# EAGLE board modular_expansion_system_graphics_and_sound (EAGLE 9.2.1)
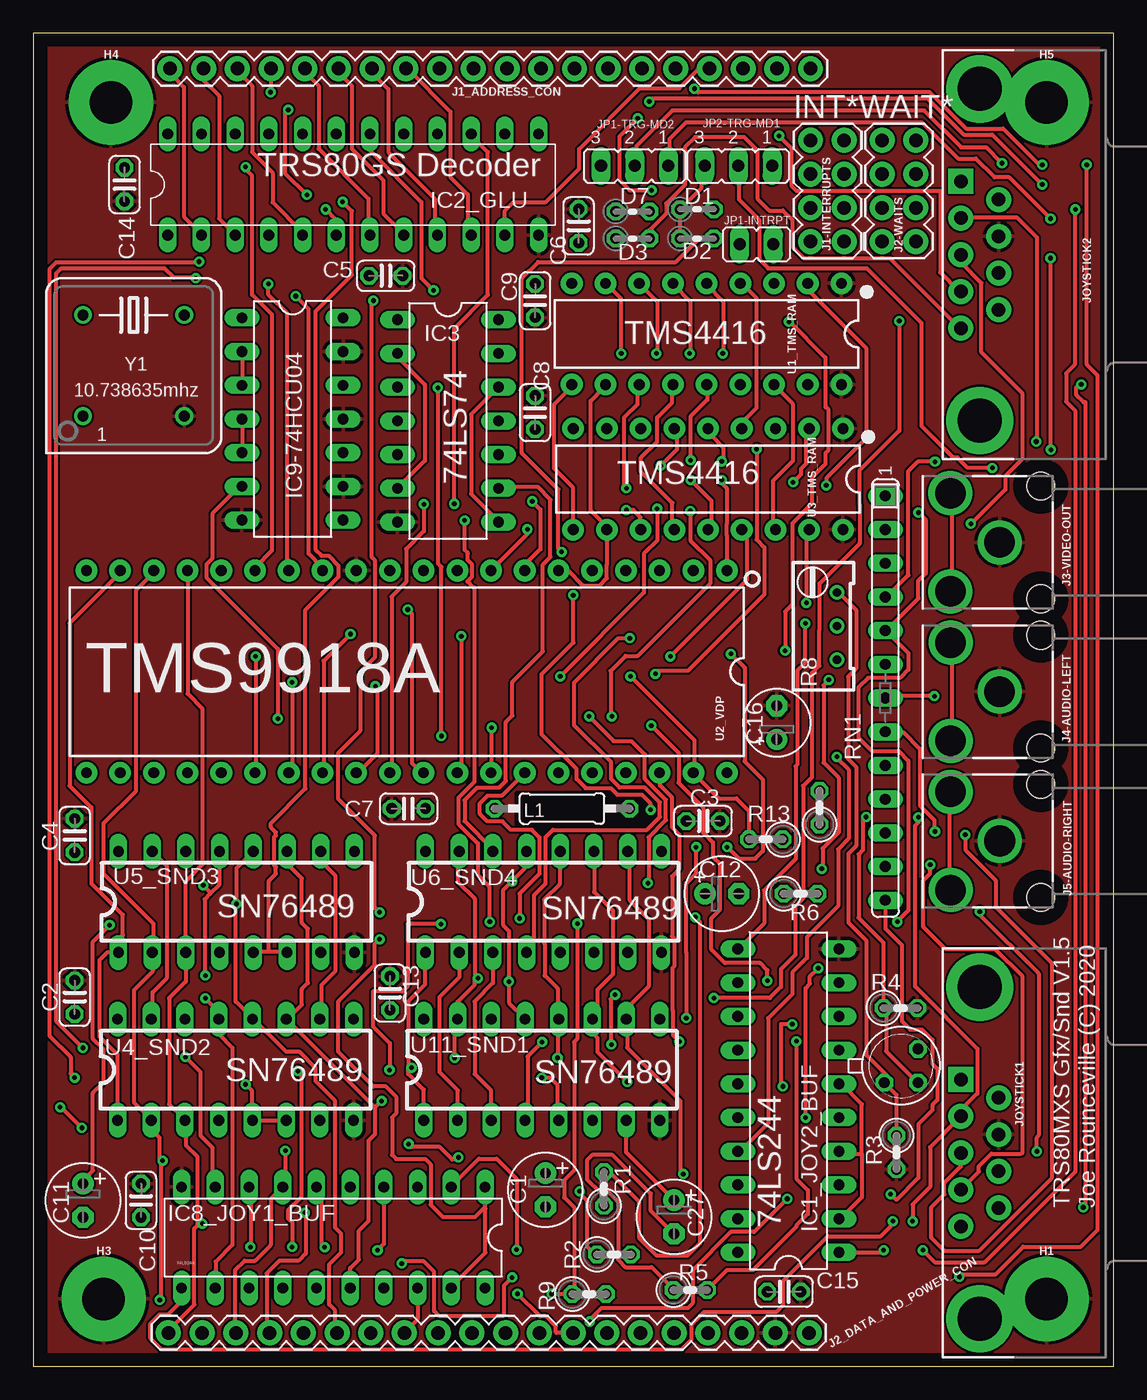
[diagram p1: board, top side]
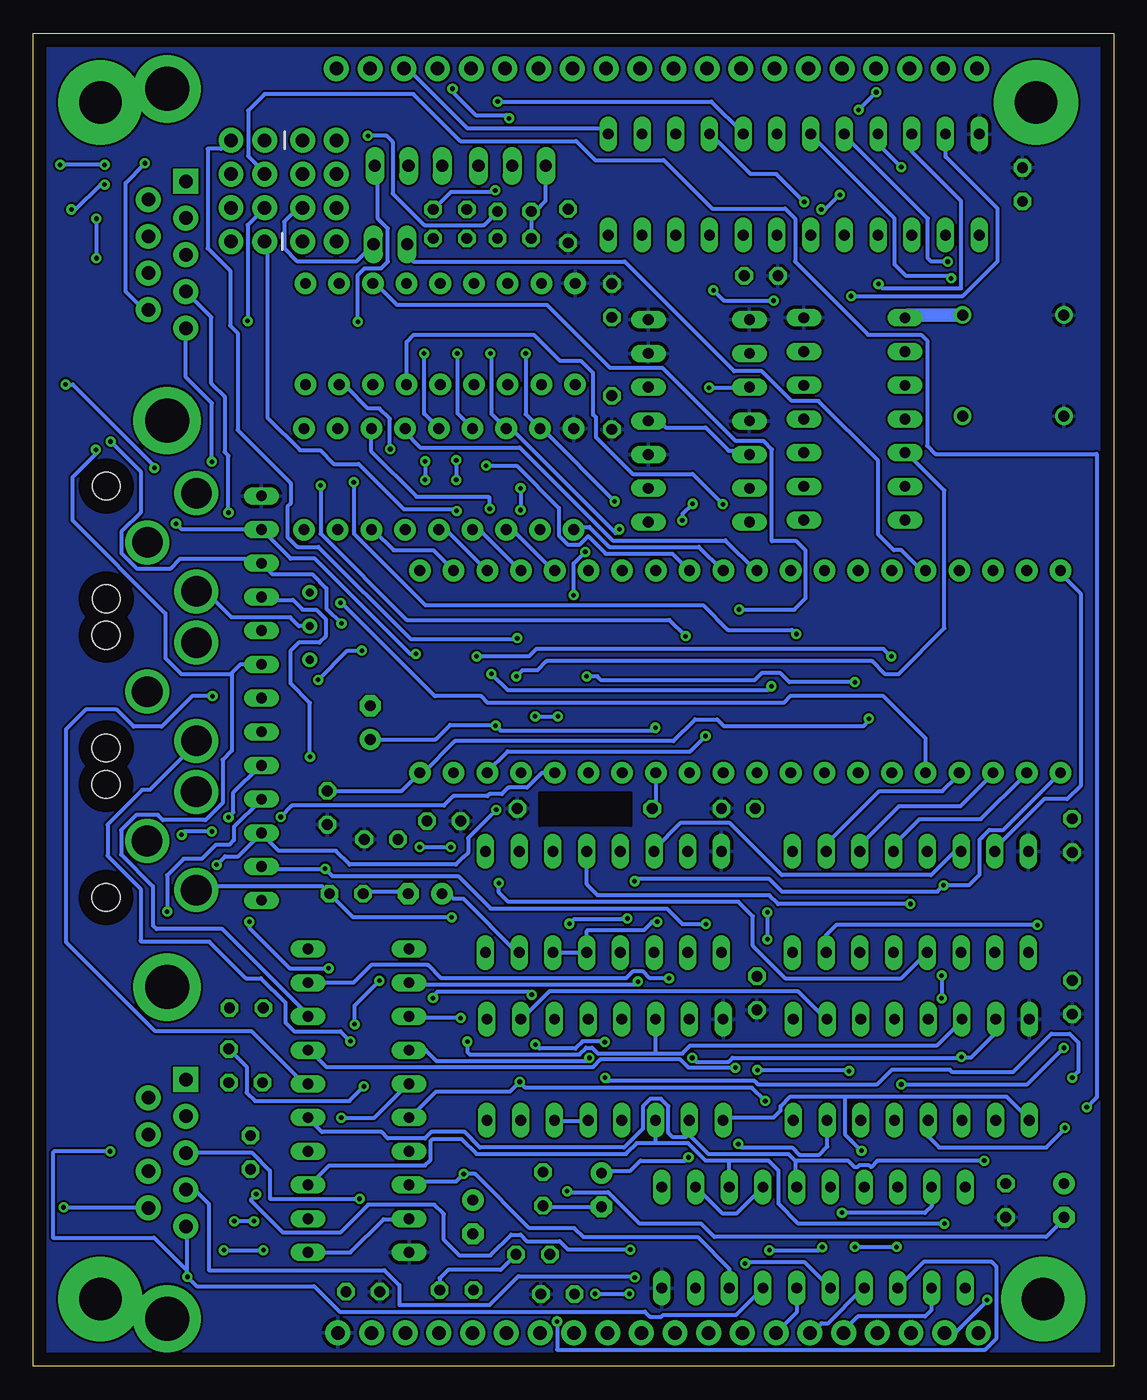
[diagram p2: board, bottom side, seen from below]

Size 81.4 x 100.47 mm. Coordinates in mm from the lower left corner, seen from the top.
Outline: 0,0 81.4,0 81.4,100.47 0,100.47 0,0
Copper layers (1*16): Top 0.035mm / dielectric 1.5mm / Bottom 0.035mm
Design rules "default": minimum track width 6mil, minimum drill 0.35mm, track to track 6mil, track to pad 6mil, pad to pad 6mil, via to via 6mil, smd to smd 6mil, copper to edge 40mil, drill to drill 6mil, minimum pad ring 10mil, minimum via ring 8mil, stop-mask expansion 4mil, vias tented up to drill 0mil, thermal gap 10mil
Net classes: 0 default: width 0.3 mm

## Footprints (pad centres in the part's own frame; a part is rotated, then mirrored left to right if it is on the bottom)
E2,5-6 = drill 0.813 pad 1.6: + -1.27,0 | drill 0.813 pad 1.6 octagon: - 1.27,0
C025-024X044 = drill 0.813 octagon: 1 -1.27,0; 2 1.27,0
E2,5-5 = drill 0.813 pad 1.6: + -1.27,0 | drill 0.813 pad 1.6 octagon: - 1.27,0
0204V = drill 0.813 octagon: 1 -1.27,0; 2 1.27,0
STANDOFF-ELECTRICAL = drill 3.2 pad 6.35: P1 0,0
DIL20 = drill 0.813 long: 1 -11.43,-3.81; 2 -8.89,-3.81; 3 -6.35,-3.81; 4 -3.81,-3.81; 5 -1.27,-3.81; 6 1.27,-3.81; 7 3.81,-3.81; 8 6.35,-3.81; 9 8.89,-3.81; 10 11.43,-3.81; 11 11.43,3.81; 12 8.89,3.81; 13 6.35,3.81; 14 3.81,3.81; 15 1.27,3.81; 16 -1.27,3.81; 17 -3.81,3.81; 18 -6.35,3.81; 19 -8.89,3.81; 20 -11.43,3.81
DIP24SKI = drill 0.813 pad 1.27 long: 1 -11.43,-3.81; 2 -8.89,-3.81; 3 -6.35,-3.81; 4 -3.81,-3.81; 5 -1.27,-3.81; 6 1.27,-3.81; 7 3.81,-3.81; 8 6.35,-3.81; 9 8.89,-3.81; 10 11.43,-3.81; 11 13.97,-3.81; 12 16.51,-3.81; 13 16.51,3.81; 14 13.97,3.81; 15 11.43,3.81; 16 8.89,3.81; 17 6.35,3.81; 18 3.81,3.81; 19 1.27,3.81; 20 -1.27,3.81; 21 -3.81,3.81; 22 -6.35,3.81; 23 -8.89,3.81; 24 -11.43,3.81
DIL14 = drill 0.813 long: 1 -7.62,-3.81; 2 -5.08,-3.81; 3 -2.54,-3.81; 4 0,-3.81; 5 2.54,-3.81; 6 5.08,-3.81; 7 7.62,-3.81; 8 7.62,3.81; 9 5.08,3.81; 10 2.54,3.81; 11 0,3.81; 12 -2.54,3.81; 13 -5.08,3.81; 14 -7.62,3.81
2X4 = drill 1.016 pad 1.88: 1 -3.81,-1.27; 2 -3.81,1.27; 3 -1.27,-1.27; 4 -1.27,1.27; 5 1.27,-1.27; 6 1.27,1.27; 7 3.81,-1.27; 8 3.81,1.27
1X20 = drill 1.016 pad 1.88: 1 0,0; 2 2.54,0; 3 5.08,0; 4 7.62,0; 5 10.16,0; 6 12.7,0; 7 15.24,0; 8 17.78,0; 9 20.32,0; 10 22.86,0; 11 25.4,0; 12 27.94,0; 13 30.48,0; 14 33.02,0; 15 35.56,0; 16 38.1,0; 17 40.64,0; 18 43.18,0; 19 45.72,0; 20 48.26,0
RCA = drill 2.3: PIN 3.7,3.7; SHELL 0,0; SWITCH 3.7,-3.7 | hole 2.1: -3.1,4.25; -3.1,-4.25
DB9 = drill 1.016 pad 1.88 square: 1 -5.54,-1.42 | drill 1.016 pad 1.88: 2 -2.77,-1.42; 3 0,-1.42; 4 2.77,-1.42; 5 5.54,-1.42; 6 -4.15,1.42; 7 -1.38,1.42; 8 1.38,1.42; 9 4.15,1.42 | drill 3.302 pad 5.08: G1 -12.5,0; G2 12.5,0
JP1 = drill 0.914 long: 1 0,-1.27; 2 0,1.27
JP2 = drill 0.914 long: 1 -2.54,0; 2 0,0; 3 2.54,0
0207/10 = drill 0.813 octagon: 1 -5.08,0; 2 5.08,0
TO18A = drill 0.813 octagon: B 1.27,-1.27; C 1.27,1.27; E -1.27,-1.27
0207/2V = drill 0.813 octagon: 1 -1.27,0; 2 1.27,0
RTRIM64W = drill 0.61: 1 1.27,-2.54; 2 1.27,0; 3 1.27,2.54
SIL13 = drill 0.813 long: 1 -15.24,0; 2 -12.7,0; 3 -10.16,0; 4 -7.62,0; 5 -5.08,0; 6 -2.54,0; 7 0,0; 8 2.54,0; 9 5.08,0; 10 7.62,0; 11 10.16,0; 12 12.7,0; 13 15.24,0
DIP18 = drill 0.813 pad 1.626: 1 -10.16,-3.81; 2 -7.62,-3.81; 3 -5.08,-3.81; 4 -2.54,-3.81; 5 0,-3.81; 6 2.54,-3.81; 7 5.08,-3.81; 8 7.62,-3.81; 9 10.16,-3.81; 10 10.16,3.81; 11 7.62,3.81; 12 5.08,3.81; 13 2.54,3.81; 14 0,3.81; 15 -2.54,3.81; 16 -5.08,3.81; 17 -7.62,3.81; 18 -10.16,3.81
DIP40_MCU = drill 0.813 pad 1.626: P1 -24.13,-7.62; P2 -21.59,-7.62; P3 -19.05,-7.62; P4 -16.51,-7.62; P5 -13.97,-7.62; P6 -11.43,-7.62; P7 -8.89,-7.62; P8 -6.35,-7.62; P9 -3.81,-7.62; P10 -1.27,-7.62; P11 1.27,-7.62; P12 3.81,-7.62; P13 6.35,-7.62; P14 8.89,-7.62; P15 11.43,-7.62; P16 13.97,-7.62; P17 16.51,-7.62; P18 19.05,-7.62; P19 21.59,-7.62; P20 24.13,-7.62; P21 24.13,7.62; P22 21.59,7.62; P23 19.05,7.62; P24 16.51,7.62; P25 13.97,7.62; P26 11.43,7.62; P27 8.89,7.62; P28 6.35,7.62; P29 3.81,7.62; P30 1.27,7.62; P31 -1.27,7.62; P32 -3.81,7.62; P33 -6.35,7.62; P34 -8.89,7.62; P35 -11.43,7.62; P36 -13.97,7.62; P37 -16.51,7.62; P38 -19.05,7.62; P39 -21.59,7.62; P40 -24.13,7.62
DIP16 = drill 0.813 long: P1 -8.89,-3.81; P2 -6.35,-3.81; P3 -3.81,-3.81; P4 -1.27,-3.81; P5 1.27,-3.81; P6 3.81,-3.81; P7 6.35,-3.81; P8 8.89,-3.81; P9 8.89,3.81; P10 6.35,3.81; P11 3.81,3.81; P12 1.27,3.81; P13 -1.27,3.81; P14 -3.81,3.81; P15 -6.35,3.81; P16 -8.89,3.81
CPP-4 = drill 0.813: 1 -3.81,-3.81; 4 3.81,-3.81; 5 3.81,3.81; 8 -3.81,3.81

## Placement (x,y rotation side)
C1  10uf  [E2,5-6]  38.59,13.29 270 top
C2  .1uf  [C025-024X044]  3.12,27.81 90 top
C3  .1uf  [C025-024X044]  50.47,41.09 0 top
C4  .1uf  [C025-024X044]  3.12,40 90 top
C5  .1uf  [C025-024X044]  26.56,82.19 0 top
C6  .1uf  [C025-024X044]  41.09,85.94 90 top
C7  .1uf  [C025-024X044]  28.28,42.03 180 top
C8  .1uf  [C025-024X044]  37.81,71.88 90 top
C9  .1uf  [C025-024X044]  37.81,80.31 270 top
C10  .1uf  [C025-024X044]  8.12,12.5 90 top
C11  10uf  [E2,5-6]  3.75,12.5 270 top
C12  10uf  [E2,5-6]  51.88,35.62 0 top
C13  .1uf  [C025-024X044]  26.88,28.12 90 top
C14  .1uf  [C025-024X044]  6.88,89.06 270 top
C15  .1uf  [C025-024X044]  56.56,5.62 0 top
C16  22uF  [E2,5-5]  56.02,48.52 90 top
C27  10uf  [E2,5-6]  48.27,11.27 270 top
D1  (1N821)  [0204V]  50,87.19 0 top
D2  (1N821)  [0204V]  50,85 0 top
D3  (1N821)  [0204V]  45.16,85 0 top
D7  (1N821)  [0204V]  45.16,87.03 0 top
H1  STANDOFF_ELECTRICAL  [STANDOFF-ELECTRICAL]  76.34,5.08 0 top
H3  STANDOFF_ELECTRICAL  [STANDOFF-ELECTRICAL]  5.31,5.08 0 top
H4  STANDOFF_ELECTRICAL  [STANDOFF-ELECTRICAL]  5.86,95.25 0 top
H5  STANDOFF_ELECTRICAL  [STANDOFF-ELECTRICAL]  76.34,95.25 0 top
IC1_JOY2_BUF  74LS244N  [DIL20]  56.89,20.02 90 top
IC2_GLU  ATF22V10  [DIP24SKI]  21.56,89.06 0 top
IC3  74LS74N  [DIL14]  31.25,71.25 270 top
IC8_JOY1_BUF  74LS244N  [DIL20]  22.61,9.71 180 top
IC9-74HCU04  74LS04N  [DIL14]  19.54,71.39 270 top
J1-INTERRUPTS  INTERRUPTS  [2X4]  59.83,88.58 90 top
J1_ADDRESS_CON  j1  [1X20]  10.3,97.79 0 top
J2-WAITS  WAITS  [2X4]  65.23,88.58 270 top
J2_DATA_AND_POWER_CON  j2  [1X20]  58.45,2.52 180 top
J3-VIDEO-OUT  RCA  [RCA]  72.8,62.09 180 top
J4-AUDIO-LEFT  RCA  [RCA]  72.81,50.84 180 top
J5-AUDIO-RIGHT  RCA  [RCA]  72.81,39.59 180 top
JOYSTICK1  Female  [DB9]  71.31,16.09 270 top
JOYSTICK2  Female  [DB9]  71.31,83.77 270 top
JP1-INTRPT  INT__VDP_JP  [JP1]  54.5,84.56 90 top
JP1-TRG-MD2  JP1  [JP2]  45.31,90.47 180 top
JP2-TRG-MD1  JP2  [JP2]  53.12,90.47 180 top
L1  6.8uH  [0207/10]  39.84,42.03 0 top
Q2  2N2222  [TO18A]  65.39,22.65 0 top
R1  150k  [0207/2V]  42.99,13.38 90 top
R2  150k  [0207/2V]  43.75,8.44 0 top
R3  75  [0207/2V]  65.04,16.12 270 top
R4  470  [0207/2V]  65.33,27 0 top
R5  150k  [0207/2V]  49.51,5.75 0 top
R6  150k  [0207/2V]  57.81,35.62 0 top
R8  400  [RTRIM64W]  59.28,55.79 0 top
R9  4.7k  [0207/2V]  41.88,5.44 0 top
R12  2k  [0207/2V]  59.24,42.1 90 top
R13  2k  [0207/2V]  55.19,39.71 180 top
RN1  4.7k  [SIL13]  64.2,50.36 270 top
U1_TMS_RAM  TMS4416  [DIP18]  50.73,77.8 180 top
U2_VDP  TMS9118  [DIP40_MCU]  28.14,52.35 180 top
U3_TMS_RAM  TMS4416  [DIP18]  50.84,66.86 180 top
U4_SND2  SN76489  [DIP16]  15.24,22.35 0 top
U5_SND3  SN76489  [DIP16]  15.31,35 0 top
U6_SND4  SN76489  [DIP16]  38.44,35 0 top
U11_SND1  SN76489  [DIP16]  38.32,22.35 0 top
Y1  OSC1-CPP-4  [CPP-4]  7.57,75.42 0 top

## Tracks (layer width: path | path; a pad name or v marks a point on that pad's centre or on a via)
5_BIT_TRIGGER_LINE  (via drill 0.35)
  Top 0.3: v16.36,9 16.44,9 16.44,13.5 IC8_JOY1_BUF.8 | v19.94,22.25 20.19,22.25 20.19,12.75 19.19,11.75 19.19,11.17 19.5,10.86 v19.5,9 | v30.72,33.33 28.2,33.33 28.2,28.64 27.81,28.25 25.59,28.25 25.59,25.62 26.88,24.34 26.88,22.34 26.86,22.34 v26.84,22.33 | v59.94,51.73 59.55,51.34 59.55,45.5 60.67,44.38 60.67,40.23 59.47,39.03 59.47,37.56 v59.41,37.5 | v56.94,78.72 57,78.72 59.69,76.03 59.69,72.27 59.77,72.27 59.88,72.15 59.88,69.03 59.69,68.83 59.69,68 58.66,66.97 58.66,65.02 57.94,64.3 57.94,64.25 57.19,63.5 57.19,57.42 56.64,56.88 v56.64,53.94
  Bottom 0.3: v19.5,9 v16.36,9 | v26.84,22.33 20.02,22.33 v19.94,22.25 | v30.72,33.33 32.48,33.33 33.66,34.5 46.94,34.5 49.39,36.95 58.86,36.95 v59.41,37.5 64.19,37.5 RN1.12 | v56.94,78.72 56.94,82.25 56.44,82.75 55.19,82.75 54.69,83.25 54.69,85.75 55.44,86.5 55.44,90.25 JP2-TRG-MD1.1 | v59.94,51.73 57.73,53.94 v56.64,53.94
5_BIT_TRIGGER_LINE_2  (via drill 0.35)
  Top 0.3: JP1-TRG-MD2.1 47.94,90.5 47.94,92.5 49.19,93.75 66.94,93.75 69.67,91.02 71.02,91.02 72.42,89.61 73.52,89.61 v76.64,86.48 | v76.64,83.52 76.67,83.48 v76.67,69.08
  Bottom 0.3: 66.44,52.25 66.44,46.41 67.13,45.71 67.13,42.45 68.41,41.17 71.62,41.17 72,41.55 73.63,41.55 74.78,40.41 74.78,38.57 72.38,36.17 72.38,33.22 72.11,32.95 67.14,32.95 60.94,26.75 60.94,26.5 IC1_JOY2_BUF.8 | 66.44,52.25 66.5,52.19 70.25,52.19 71.44,53.38 71.44,56.75 78.44,63.75 78.44,67 76.67,68.77 v76.67,69.08 | v76.64,86.48 v76.64,83.52 | RN1.6 65.78,52.9 66.44,52.25
A0
  Top 0.3: IC2_GLU.2 12.5,85.5 11.34,86.66 11.34,96.41 10.5,97.25 10.5,97.75 J1_ADDRESS_CON.1
A1
  Top 0.3: IC2_GLU.3 15,85.5 14,86.5 14,95.75 12.75,97 12.75,97.75 J1_ADDRESS_CON.2
A2
  Top 0.3: IC2_GLU.5 20.25,85.5 18.03,87.72 18.03,89.97 16.5,91.5 16.5,96.5 15.5,97.5 15.5,97.75 J1_ADDRESS_CON.3
A3  (via drill 0.35)
  Top 0.3: v20.63,88.28 20.59,88.28 19,89.88 19,94.47 v19.22,94.69 | IC2_GLU.6 22.83,86.39 v22.03,87.19 | J1_ADDRESS_CON.4 17.89,97.76 v17.89,96.02
  Bottom 0.3: v20.63,88.28 21.72,87.19 v22.03,87.19 | v17.89,96.02 v19.22,94.69
A4
  Top 0.3: IC2_GLU.7 25.25,85.5 25.25,88 21.5,91.75 21.5,96.5 20.5,97.5 20.5,97.75 J1_ADDRESS_CON.5
A5
  Top 0.3: J1_ADDRESS_CON.6 23,97.5 24,96.5 24,91.75 26.38,89.38 26.38,86.88 27.75,85.5 IC2_GLU.8
A6
  Top 0.3: IC2_GLU.9 30.25,85.5 30.25,88 26.75,91.5 26.75,96.25 25.75,97.25 25.75,97.75 J1_ADDRESS_CON.7
A7
  Top 0.3: IC2_GLU.10 32.75,85.5 32.75,88.31 31.44,89.62 31.44,94.56 28.25,97.75 J1_ADDRESS_CON.8
CLK-IN-1  (via drill 0.35)
  Top 0.3: v18.44,48.81 18.44,54.06 13.05,59.45 13.05,60.43 13.5,60.88 13.5,64.25 15.5,66.25 IC9-74HCU04.6
  Bottom 0.3: v18.44,48.81 18.44,48.66 18.84,48.25 29.38,48.25 29.88,48.75 31.53,48.75 33.17,47.11 49.64,47.11 52.02,44.73 U2_VDP.P40 53.63,43.37 R12.2
CLK-IN-2  (via drill 0.35)
  Top 0.3: IC9-74HCU04.5 15.75,69 15.75,71.25 IC9-74HCU04.4 | v45,52 49.81,47.19 49.81,44.81 U2_VDP.P39 51.65,42.81 52.97,42.81 53.92,41.86 R13.2
  Bottom 0.3: IC9-74HCU04.5 15.5,68.75 12.75,66 12.75,55.62 16.19,52.19 17.25,52.19 18.2,53.14 42.73,53.14 43.41,52.47 44.53,52.47 v45,52
CLK-OUT
  Bottom 1.016: Y1.5 15.51,79.23 IC9-74HCU04.1
CLOCK_DIV_4
  Top 0.3: IC3.9 35.25,66.25 38.03,66.25 38.97,65.31 38.97,61 38.41,60.44 38.41,53.88 36.09,51.56 36.09,49.03 35.61,48.54 35.61,44.11 35.08,43.59 33.42,43.59 32.5,42.67 32.5,41.09 34.63,38.97 U6_SND4.P14
  Bottom 0.3: U5_SND3.P14 11.97,38.81 13.75,37.03 25,37.03 28.91,40.94 32.66,40.94 34.63,38.97 U6_SND4.P14
COMVID  (via drill 0.35)
  Top 0.3: Q2.B 66.5,21.5 64.25,23.75 64.25,27 R4.1 64.05,27 64.05,31.94 62.19,33.8 62.19,38.59 62.5,38.91 62.5,41.16 v62.75,41.41
  Bottom 0.3: v62.75,41.41 61.91,42.25 50.47,42.25 49.75,42.97 47.19,42.97 47.03,43.12 46.09,43.12 45.6,43.62 44.19,43.62 43.07,44.73 U2_VDP.P36
COMVID-OUT
  Top 0.3: R8.3 60.75,58.25 62,57 62,52.58 61.39,51.97 61.39,45.78 62,45.17 62,39.22 61.41,38.62 61.41,33.44 62.75,32.09 62.75,23.47 64.16,22.06 64.16,21.5 64.12,21.46 Q2.E 65.04,20.46 R3.1
CSR  (via drill 0.35)
  Top 0.3: v16,90.38 16,90.22 16.5,89.72 16.5,80.75 18,79.25 18,61.5 16.75,60.25 16.75,60 U2_VDP.P15
  Bottom 0.3: v16,90.38 17.74,92.11 IC2_GLU.21
CSW  (via drill 0.35)
  Top 0.3: U2_VDP.P14 19.25,60.72 19.13,60.84 19.13,79.38 17.72,80.78 v17.72,81.56
  Bottom 0.3: IC2_GLU.22 15.21,91.53 11.5,87.81 11.5,81.25 17.41,81.25 v17.72,81.56
D0  (via drill 0.35)
  Top 0.3: U11_SND1.P3 34.5,18.75 34.5,20.78 33.25,22.03 33.25,27.5 34.63,28.88 U6_SND4.P3 | 12.34,10.59 12.34,15.81 11.5,16.66 11.5,18.5 U4_SND2.P3 11.25,18.75 10.25,19.75 10.25,27.75 11.5,29 11.5,31 U5_SND3.P3 11.44,31.25 11.44,36.5 12.75,37.81 12.75,49.57 11.63,50.69 U2_VDP.P17 | J2_DATA_AND_POWER_CON.20 10.25,2.75 12.14,4.64 12.14,10.39 12.34,10.59 | v12.75,10.75 12.5,10.75 12.34,10.59
  Bottom 0.3: IC1_JOY2_BUF.3 60.5,13.75 59.11,15.14 51.89,15.14 51.46,15.57 51.46,16.96 51.28,17.14 49.14,17.14 48,16 36.75,16 35.94,16.81 34.53,16.81 | v12.75,10.75 23.75,10.75 25.25,12.25 25.25,14.75 26,15.5 28.91,15.5 | 34.53,16.81 32.06,16.81 30.75,15.5 28.91,15.5 | U11_SND1.P3 34.53,18.52 34.53,16.81 | IC8_JOY1_BUF.3 28.96,15.45 28.91,15.5
D1  (via drill 0.35)
  Top 0.3: U2_VDP.P18 9,59.75 7.75,58.5 7.75,43.38 5.31,40.94 5.31,37.12 9.06,33.38 9.06,31.29 U5_SND3.P2 9,31 9,29.75 7.59,28.34 7.59,19.91 8.75,18.75 U4_SND2.P2 9,18.5 9,17.75 9.5,17.25 9.5,15.5 v9.75,15.5 9.59,15.34 9.59,5.06 v9.53,5 | U6_SND4.P2 32.09,29.31 30.59,27.81 30.59,22.19 32,20.78 32,18.57 U11_SND1.P2
  Bottom 0.3: 24,15.5 24,13.75 IC8_JOY1_BUF.5 | IC1_JOY2_BUF.5 60.5,18.5 59.66,17.66 55.16,17.66 54.67,17.17 51.89,17.17 51.41,17.66 48.91,17.66 47.75,16.5 36.89,16.5 35.48,17.91 35.48,19.6 34.91,20.16 34.11,20.16 33.55,19.6 33.55,17.61 33.2,17.27 32.27,17.27 31.97,17.56 U11_SND1.P2 31.97,17.44 30.53,16 24.5,16 24,15.5 | v9.75,15.5 17.81,15.5 17.81,15.47 18.27,15.01 18.4,15.14 19.2,15.14 19.33,15.01 19.51,15.01 20,15.5 24,15.5 | v9.53,5 9.53,4.94 11.95,2.52 J2_DATA_AND_POWER_CON.19
D2  (via drill 0.35)
  Top 0.3: U2_VDP.P19 6.5,59.75 2.75,56 2.75,43.75 4.38,42.12 4.38,36.41 6.75,34.03 6.75,32.5 6.5,32.25 6.5,31.25 U5_SND3.P1 5.57,31.19 5,30.62 5,24.84 6.36,23.49 U4_SND2.P1 | 28.25,22.5 28.25,27.5 29.5,28.75 29.5,31 U6_SND4.P1 | 28.25,22.5 28.25,22.03 29.43,20.85 U11_SND1.P1 | 28.25,22.5 v28.5,22.5 | v19,16.25 19,13.75 IC8_JOY1_BUF.7 17.89,12.61 17.89,9.12 16.73,7.96 15.93,7.96 15.23,7.27 15.23,2.56 J2_DATA_AND_POWER_CON.18
  Bottom 0.3: v19,16.25 20.25,17.5 20.25,20.34 | U11_SND1.P1 29.25,18.75 25.63,18.75 25.1,19.28 25.1,19.6 24.35,20.34 20.25,20.34 | 20.25,20.34 8.09,20.34 6.5,18.75 U4_SND2.P1 | IC1_JOY2_BUF.7 60.58,23.83 59.3,22.55 39.24,22.55 38.66,23.12 32.66,23.12 32.03,22.5 v28.5,22.5
D3  (via drill 0.35)
  Top 0.3: 33.25,29.25 33.25,35.25 32,36.5 32,38.75 U6_SND4.P15 | 33.25,29.25 33.25,28.75 31.97,27.47 U11_SND1.P15 31.75,26 v31.75,23.25 | 33.25,29.25 v33.5,29.25 | v11.47,23.31 12.59,22.19 12.59,17.41 13.5,16.5 13.5,13.75 IC8_JOY1_BUF.9 | U5_SND3.P15 9,38.75 10.09,37.66 10.09,29.28 9,28.19 9,26.25 U4_SND2.P15 | v20.47,11.58 20.55,11.5 20.55,8.52 20,7.97 18.55,7.97 17.58,7 17.58,2.75 J2_DATA_AND_POWER_CON.17
  Bottom 0.3: v33.5,29.25 34.94,29.25 35.44,29.75 36.25,29.75 36.75,29.25 50.66,29.25 51.66,30.25 55.94,30.25 57.28,28.91 IC1_JOY2_BUF.9 | U4_SND2.P15 9,26 9,25 10.75,23.25 11.53,23.25 | U2_VDP.P20 4,59.75 2.5,58.25 2.5,43.75 3.5,42.75 5.25,42.75 9,39 U5_SND3.P15 | 11.53,23.25 v11.47,23.31 | IC8_JOY1_BUF.9 13.72,12.06 14.22,11.56 20.45,11.56 v20.47,11.58 | v31.75,23.25 31.45,22.95 29.01,22.95 28.71,23.25 11.53,23.25
D4  (via drill 0.35)
  Top 0.3: U11_SND1.P13 37,26.25 35.84,27.41 v35.84,29 35.84,32.81 35.39,33.27 35.39,35.86 v36.09,36.56 36.09,36.59 37,37.5 37,38.75 U6_SND4.P13 | 13.31,35.59 14,36.28 14,38.75 U5_SND3.P13 | 13.31,35.59 12.91,35.19 12.91,29.52 v12.97,29.45 | IC8_JOY1_BUF.12 13.75,6 13.75,7.89 15,9.14 15,24 14,25 14,26 U4_SND2.P13 13.97,26.73 v12.97,27.73 | v12.81,36.25 13.31,35.75 13.31,35.59
  Bottom 0.3: v35.84,29 36.09,28.75 53,28.75 IC1_JOY2_BUF.12 | J2_DATA_AND_POWER_CON.16 20.35,2.7 19.28,3.77 14.2,3.77 13.72,4.25 IC8_JOY1_BUF.12 | U2_VDP.P21 4.25,44.5 8.31,40.44 9.36,40.44 9.93,39.87 9.93,39.86 10.09,39.69 10.09,37.06 10.91,36.25 v12.81,36.25 13.28,35.78 25,35.78 25.94,36.72 35.94,36.72 v36.09,36.56 | v12.97,29.45 v12.97,27.73
D5  (via drill 0.35)
  Top 0.3: U6_SND4.P12 39.66,38.8 39.66,36.33 38.5,35.17 38.5,31.88 38.52,31.86 38.52,29.45 39.5,28.47 39.5,26.25 U11_SND1.P12 39.5,26.07 v39.5,23.25 | J2_DATA_AND_POWER_CON.15 22.75,2.75 22.75,4.22 22.3,4.67 22.3,7.68 23.2,8.58 23.2,10 22.75,10.45 22.75,20 21.25,21.5 21.25,22.5 20.03,23.72 19.03,23.72 16.75,26 U4_SND2.P12 16.5,26.25 15.25,27.5 15.25,34.78 v15.31,34.84 15.31,37.54 U5_SND3.P12
  Bottom 0.3: v39.5,23.25 39.75,23 51,23 51.81,23.81 53.07,23.81 IC1_JOY2_BUF.14 | IC8_JOY1_BUF.14 19,5.75 21.5,3.25 22,3.25 22.5,2.75 22.75,2.75 J2_DATA_AND_POWER_CON.15 | U5_SND3.P12 16.58,39.29 14.63,41.25 10,41.25 6.75,44.5 U2_VDP.P22 | U6_SND4.P12 39.69,38.79 39.69,36.33 38.86,35.5 25.94,35.5 25.28,34.84 v15.31,34.84
D6  (via drill 0.35)
  Top 0.3: U6_SND4.P11 42.25,38.75 42.25,35.75 43.69,34.31 43.69,29.57 42.5,28.38 42.5,26.5 42.25,26.25 U11_SND1.P11 42.25,26 42.25,25 42.5,24.75 42.5,23.69 v44.75,21.44 | U5_SND3.P11 19.25,38.75 19.25,37.75 20.25,36.75 20.25,33.42 20.7,32.97 20.7,28.89 20.25,28.44 20.25,27.25 19.25,26.25 U4_SND2.P11 19.25,26 25.75,19.5 | 25.75,19.5 25.75,17.5 25.25,17 25.25,10.94 24.53,10.22 24.53,8.05 23.88,7.4 IC8_JOY1_BUF.16 | 25.75,19.5 v26.25,20
  Bottom 0.3: IC1_JOY2_BUF.16 53,18.75 51.03,20.72 45.47,20.72 v44.75,21.44 44.31,21 27.25,21 v26.25,20 | U5_SND3.P11 19.12,39.25 16.16,42.22 11.53,42.22 9.25,44.5 U2_VDP.P23 | IC8_JOY1_BUF.16 23.88,4.07 J2_DATA_AND_POWER_CON.14
D7  (via drill 0.35)
  Top 0.3: U4_SND2.P10 21.72,26.23 21.72,28.72 22.75,29.75 22.75,37 21.75,38 21.75,38.75 U5_SND3.P10 | IC8_JOY1_BUF.18 28.96,3.54 27.96,2.54 J2_DATA_AND_POWER_CON.13 | v48.97,14.5 48.75,14.72 48.75,20 44.75,24 44.75,26 U11_SND1.P10 44.75,26.25 44.75,27 46.36,28.61 46.36,33.7 44.91,35.16 44.91,38.78 U6_SND4.P10
  Bottom 0.3: U2_VDP.P24 11.75,44.5 12.91,43.34 17.66,43.34 21.5,39.5 21.5,39 U5_SND3.P10 | IC8_JOY1_BUF.18 28.95,5.9 28.95,7.34 31.35,9.74 39.96,9.74 40.63,10.41 44.02,10.41 48.11,14.5 v48.97,14.5 49.53,13.94 49.53,13.92 52.83,13.92 IC1_JOY2_BUF.18 | U4_SND2.P10 21.75,26.25 23.75,28.25 42.53,28.25 44.62,26.16 U11_SND1.P10
DOWN  (via drill 0.35)
  Top 0.3: v27.77,7.75 27.92,7.91 29.42,7.91 30.2,7.12 30.2,4.17 30.59,3.78 35.42,3.78 35.45,3.81 35.45,6.08 v36.08,6.7 | v67.58,37.8 67.58,37.14 67.06,36.62 67.06,33.12 68.76,31.43 72.49,31.43 74.53,29.38 74.53,16.09 74.45,16.02 72.19,16.02 71.25,15.08 71.25,14.68 JOYSTICK1.4 | D2.2 50.19,85 48.41,83.22 38.03,83.22 36.81,82 36.81,68.83 39.56,66.08 39.56,61.62 v39.81,61.38 | v40.69,58.11 40.69,54.55 38.31,52.17 38.31,47.62 40.94,45 40.94,44.25 41.62,43.57 43.49,43.57 43.98,43.08 45.84,43.08 46.52,42.41 v46.52,41.94
  Bottom 0.3: v27.77,7.75 27.77,7.88 23.31,7.88 21.44,6 IC8_JOY1_BUF.15 | JOYSTICK1.4 69.24,13.31 68.16,12.23 68.16,7.25 54.94,7.25 53.81,6.12 53.81,4.62 47.02,4.62 44.84,6.8 36.17,6.8 v36.08,6.7 | v39.81,61.38 40.69,60.5 v40.69,58.11 | v46.52,41.94 48.64,39.81 48.64,38.7 48.98,38.36 49,38.38 49.53,37.84 49.53,37.81 57.56,37.81 58.59,38.84 62.91,38.84 64.06,40 64.06,40.12 RN1.11 64.2,40.17 65.94,38.44 66.94,38.44 v67.58,37.8
DOWN1  (via drill 0.35)
  Top 0.3: v58.19,18.73 58.19,28.5 58.52,28.83 58.52,29.38 v59.14,30 | v65.11,33.5 65.11,33.53 65.94,34.36 65.94,45.62 65.2,46.36 63.19,46.36 62.17,47.38 62.17,51.14 62.91,51.88 65.31,51.88 65.94,52.5 65.94,53.75 64.31,55.38 RN1.5 64.31,55.5 66.69,57.88 66.69,59.22 67.27,59.8 67.27,63.77 v66.69,64.34 | v56.19,92.73 56.19,92.72 57.11,91.8 57.11,88.98 57.5,88.59 68.33,88.59 68.33,82.45 69.78,81 JOYSTICK2.4
  Bottom 0.3: D7.2 46.44,87 47.44,86 51.94,86 54.31,88.38 54.31,92.28 54.77,92.73 v56.19,92.73 | v58.19,18.73 55.7,18.73 53.19,21.25 IC1_JOY2_BUF.15 | v65.11,33.5 65.11,33.05 62.06,30 v59.14,30 | v66.69,64.34 66.69,68.62 66.97,68.91 66.97,73.06 67.97,74.06 67.97,79.06 69.89,80.98 JOYSTICK2.4
GND
  pour Top: 81.56,0 81.56,100 0.62,100 0.62,0
  cutout Bottom: 36.41,43.2 36.41,40.78 43.2,40.78 43.2,43.2
IN*
  Top 0.3: IC2_GLU.11 35.53,87.09 36.17,87.73 38.62,87.73 41.13,90.25 41.13,91.74 45.7,96.31 48.68,96.31 50.16,97.79 J1_ADDRESS_CON.17
JOY1_IN_ENABLE_N  (via drill 0.35)
  Top 0.3: 34,11.97 33.27,11.23 30.88,11.23 29.94,12.17 29.94,15.22 29.53,15.62 27.34,15.62 27.03,15.94 27.03,18.75 27.34,19.06 27.34,20.31 26.56,21.09 25.61,21.09 23,23.7 23,27.5 25.75,30.25 25.75,31.84 v26.09,32.19 | 34,11.97 34,13.5 IC8_JOY1_BUF.1 | IC8_JOY1_BUF.19 31.5,6 34.06,8.56 34.06,11.91 34,11.97 | IC2_GLU.18 25.44,92.81 25.44,91.56 29.25,87.75 29.25,82 v30.16,81.09 | v25.63,80.31 25.5,80.19 25.5,61 25.75,60.75 25.75,53.43 24.63,52.31 24.63,47.86 23,46.23 23,42.75 25.75,40 25.75,34.56 v26.09,34.22
  Bottom 0.3: v30.16,81.09 29.38,80.31 v25.63,80.31 | v26.09,34.22 v26.09,32.19
JOY2_IN_ENABLE_N  (via drill 0.35)
  Top 0.3: v46.41,95.31 46.64,95.55 67.38,95.55 70.09,92.83 72.25,92.83 v76.02,89.06 | v67.03,8.75 67.97,7.81 71.64,7.81 78.5,14.67 78.5,72.03 77.81,72.72 77.81,74.84 78.5,75.53 78.5,87.17 v78.52,87.19 | IC1_JOY2_BUF.1 63.9,8.59 v64.06,8.75
  Bottom 0.3: v46.41,95.31 30.31,95.31 28,93 IC2_GLU.17 | IC1_JOY2_BUF.19 53.12,11.09 55,11.09 57.51,8.59 IC1_JOY2_BUF.1 | v78.52,87.19 78.2,87.19 76.33,89.06 v76.02,89.06 | v67.03,8.75 v64.06,8.75
LEFT  (via drill 0.35)
  Top 0.3: v41.94,3.38 41.94,3.52 42.8,4.38 49.33,4.38 49.69,4.73 49.69,7.25 52.56,10.12 54.31,10.12 v56.81,12.62 | v67.94,40.31 67.91,40.34 67.91,41.16 66.83,42.23 66.83,46.5 65.58,47.75 64.31,47.75 RN1.8 | v70.22,40.06 70.22,38.92 72.51,36.63 72.51,34.62 76.72,30.41 76.72,14.17 71.22,8.67 68.67,8.67 67.66,9.69 67.66,11.97 68.65,12.96 68.65,13.83 69.89,15.07 JOYSTICK1.3
  Bottom 0.3: v41.94,3.38 41.94,1.25 9.69,1.25 8.81,2.12 8.81,7.5 9.19,7.88 14.31,7.88 16.19,6 IC8_JOY1_BUF.13 | v56.81,12.62 63.56,12.62 63.56,14.75 64.94,16.12 69.81,16.12 JOYSTICK1.3 | v67.94,40.31 70,40.31 70.22,40.09 v70.22,40.06
LEFT1  (via drill 0.35)
  Top 0.3: v70.64,63.5 70.67,63.5 73.23,66.06 73.23,67.09 74.5,68.36 74.5,73.36 71.44,76.42 71.44,81.64 69.94,83.14 69.94,83.75 JOYSTICK2.3 | v52.56,53.69 53.59,52.66 53.59,45.59 54.97,44.22 54.97,38.83 54.4,38.26 53.15,38.26 v52.28,39.12 | v49.94,39.12 49.94,37.16 49.19,36.41 49.19,31.17 49.2,31.16 v49.2,26.25
  Bottom 0.3: v49.2,26.25 53.06,26.25 IC1_JOY2_BUF.13 | v52.28,39.12 v49.94,39.12 | v52.56,53.69 53,53.69 60.19,60.88 62,60.88 64.25,63.12 64.31,63.12 RN1.2 70.2,63.06 v70.64,63.5
N$1  (via drill 0.35)
  Top 0.3: R5.2 51,6 52.25,7.25 54.22,7.25 57.5,10.53 57.5,10.62 58.36,11.48 58.36,13.28 57.5,14.14 v57.5,24.5 | J4-AUDIO-LEFT.SWITCH 69.25,54.5 69.25,47.25 J4-AUDIO-LEFT.PIN
  Bottom 0.3: v57.5,24.5 58.25,25.25 61.75,25.25 62.39,25.89 62.39,27.39 64.25,29.25 65.38,29.25 68.13,32 73.25,32 73.31,32.06 73.31,35.99 75.79,38.47 75.79,40.83 73.19,43.44 72.6,43.44 69.25,46.79 69.25,47 J4-AUDIO-LEFT.PIN | R5.2 50.77,6.64 50.15,7.27 46.19,7.27 R2.2
N$2
  Bottom 0.3: J1-INTERRUPTS.3 61.25,87.25 61.5,87.25 62.5,86.25 62.5,84.25 61.5,83.25 57.08,83.25 JP1-INTRPT.1
N$3
  Bottom 0.3: U2_VDP.P16 14.25,60 14.5,60 16,61.5 16.56,61.5 17.75,62.69 17.75,68.25 22.25,72.75 24.25,72.75 26.5,75 28.59,75 36.84,83.25 52.75,83.25 53.23,83.73 JP1-INTRPT.2
N$4
  Top 0.3: J3-VIDEO-OUT.SWITCH 69.25,65.75 69.25,58.5 J3-VIDEO-OUT.PIN
  Bottom 0.3: J3-VIDEO-OUT.PIN 69,58.25 68.25,58.25 66.44,56.44 62.03,56.44 61.38,55.79 R8.2
N$5
  Bottom 0.3: R6.1 56.5,35.75 53.25,35.75 C12.-
N$6
  Bottom 0.3: IC3.11 34.25,71.25 33.75,70.75 30.75,70.75 29,69 27.75,69 27.5,68.75 IC3.5
N$7
  Top 0.3: IC3.8 35,63.75 33,65.75 33,71.75 35,73.75 IC3.12
N$10  (via drill 0.35)
  Top 0.3: v5.75,33.25 4.5,32 4.5,24.69 5.31,23.88 5.31,21.41 4.5,20.59 4.5,14.75 3.75,14 C11.+
  Bottom 0.3: U5_SND3.P7 21.66,32.49 20.91,33.25 v5.75,33.25
N$12
  Top 0.3: IC9-74HCU04.3 15.75,74 15.75,76.25 IC9-74HCU04.2
N$13
  Bottom 0.3: U6_SND4.P7 45,31.25 49,35.25 49.75,35.25 50,35.5 50.5,35.5 C12.+
N$14
  Top 0.3: IC3.6 27.5,66.25 29.5,68.25 29.5,74 27.5,76 27.5,76.25 IC3.2
N$16
  Bottom 0.3: R1.1 42.75,12 38.75,12 C1.-
N$17  (via drill 0.35)
  Top 0.3: R2.1 42.25,8.5 41.75,9 41.75,12.47 41.17,13.05 v41.17,13.2
  Bottom 0.3: C11.- 3.75,11.09 5.09,9.75 30.08,9.75 31.08,10.75 35.7,10.75 38.08,13.12 41.09,13.12 v41.17,13.2
N$18  (via drill 0.35)
  Top 0.3: U1_TMS_RAM.5 50.75,81.5 52,80.25 52,76.38 v51.95,76.33 | U3_TMS_RAM.5 51,70.5 51,70.25 52,69.25 52,68.33 v51.88,68.2 | v51.88,66.8 51.88,66.56 52.27,66.17 52.27,63.52 52.26,63.52 52.26,62.59 52.27,62.59 U2_VDP.P1
  Bottom 0.3: v51.88,68.2 v51.88,66.8 | U3_TMS_RAM.5 51.95,71.79 v51.95,76.33
N$21
  Top 0.3: U1_TMS_RAM.16 56,73.75 57.25,72.5 57.25,68.25 55.75,66.75 55.75,63.25 U3_TMS_RAM.16
  Bottom 0.3: U2_VDP.P2 49.75,60 51.25,61.5 54.25,61.5 55.75,63 U3_TMS_RAM.16
N$24  (via drill 0.35)
  Top 0.3: J5-AUDIO-RIGHT.PIN 69,36 69,43.18 J5-AUDIO-RIGHT.SWITCH | R1.2 43.4,14.64 45.63,12.42 45.63,9.69 46.95,8.36 49.3,8.36 50.23,9.3 50.23,12.36 50.2,12.39 50.2,33.52 v49.88,33.84
  Bottom 0.3: v49.88,33.84 57.3,33.84 R6.2 59.63,36.17 68.84,36.17 J5-AUDIO-RIGHT.PIN
N$64
  Top 0.3: R5.1 48.27,5.79 46.6,7.47 44.62,7.47 44.06,8.04 44.06,12.41 43.33,13.13 42.67,13.13 41.72,14.09 41.72,15.51 42.13,15.92 43.63,15.92 46.54,13.01 46.54,11.73 C27.-
OUT*
  Bottom 0.3: J1_ADDRESS_CON.18 53.16,97.79 48.69,93.31 38.56,93.31 38.25,93 IC2_GLU.13
RIGHT  (via drill 0.35)
  Top 0.3: v66.69,41.38 66.69,41 66.44,40.75 66.44,28.62 71.13,23.93 71.13,20.56 69.89,19.32 JOYSTICK1.2 69.81,18.75 67.57,16.51 67.57,13.52 66.25,12.2 v66.25,10.94 | v64.77,10.94 64.77,10.72 63.86,9.81 59.88,9.81 56.48,6.42 56.48,4.61 55.96,4.09 50.52,4.09 49.56,3.12 49.56,2 48.81,1.25 9.69,1.25 8.83,2.11 8.83,3.2 9.53,3.91 10.16,3.91 11.18,4.93 IC8_JOY1_BUF.11
  Bottom 0.3: v66.69,41.38 66.31,41.75 66.31,43.25 64.31,45.25 RN1.9 | v64.77,10.94 v66.25,10.94
RIGHT1  (via drill 0.35)
  Top 0.3: IC1_JOY2_BUF.11 53.19,31.5 55.06,33.38 55.06,35.88 57.44,38.25 57.44,45.22 57.58,45.36 57.58,52.42 58.13,52.97 58.13,55.94 v58.17,55.98 | v75.56,69.69 75.64,69.77 75.64,85.06 74.14,86.56 69.91,86.56 JOYSTICK2.2
  Bottom 0.3: v58.17,55.98 59.31,57.12 59.31,58.62 60.39,59.7 63.38,59.7 RN1.3 64.57,60.86 70.32,60.86 71.05,60.13 73.61,60.13 74.76,61.28 74.76,62.91 73.31,64.35 73.31,67.44 v75.56,69.69
SN76489-CLOCK  (via drill 0.35)
  Top 0.3: v30.48,73.75 30.5,73.73 30.5,60.5 30.75,60.25 v30.75,47.5 | U2_VDP.P38 47.22,44.7 47.22,43.77 48.13,42.87 48.13,40.62 48.69,40.06 48.69,37.5 48.13,36.94 48.13,32.41 48.29,32.25 48.29,30.13 48.18,30.02 48.18,26.82 48.2,26.8 48.2,24.95 v48.69,24.47
  Bottom 0.3: U4_SND2.P14 11.5,26 13.34,24.16 31.92,24.16 32.5,23.58 34.53,23.58 | v30.48,73.75 27.5,73.75 IC3.3 | v30.75,47.5 31.91,46.34 45.66,46.34 47.25,44.75 U2_VDP.P38 | v48.69,24.47 48.69,23.69 48.5,23.5 40.25,23.5 39.75,24 39.29,24 38.86,23.58 34.53,23.58 | U11_SND1.P14 34.53,26.14 34.53,23.58
SND1_ENABLE_N  (via drill 0.35)
  Top 0.3: v12.5,83.25 12.52,83.27 12.58,83.2 1.72,83.2 1.25,82.73 1.25,24.88 2.81,23.31 2.81,22.06 v3.13,21.75 | v38.31,21.75 38.94,21.75 39.5,21.19 39.5,18.75 U11_SND1.P5
  Bottom 0.3: U11_SND1.P5 39.75,18.5 42,18.5 U11_SND1.P6 | v12.5,83.25 13.75,83.25 14,83.5 14,86.5 20.25,92.75 IC2_GLU.20 | v3.13,21.75 2.66,22.22 2.66,24.41 3.31,25.06 4.69,25.06 7.59,22.16 12.16,22.16 12.34,22.34 16.72,22.34 17.81,21.25 26.8,21.25 27.05,21.5 38.06,21.5 v38.31,21.75
SND1_READY  (via drill 0.35)
  Top 0.3: v38.34,24.44 37.25,23.34 37.25,18.75 U11_SND1.P4 | v43.56,24.25 43.5,24.31 43.5,27.66 v43.84,28 | v51.28,27.75 55.5,27.75 56.33,28.58 56.33,29.92 57.42,31.02 57.42,34.67 58,35.25 58,43.75 58.67,44.42 58.67,52.27 59.22,52.81 59.22,55.52 59.25,55.55 59.25,59 62.27,62.02 62.27,64.98 62.25,65 62.25,67.5 65.25,70.5 v65.25,78.78
  Bottom 0.3: v38.34,24.44 38.34,24.5 40,24.5 40.55,23.95 43.26,23.95 v43.56,24.25 | v43.84,28 44.09,28.25 50.94,28.25 51.28,27.91 v51.28,27.75 | v65.25,78.78 65.25,86 64,87.25 J2-WAITS.5
SND2_ENABLE_N  (via drill 0.35)
  Top 0.3: U4_SND2.P6 19,18.5 16.75,18.5 U4_SND2.P5 16.5,18.75 16.5,20.75 v16,21.25 | v3.75,24 1.75,26 1.75,82.38 2.13,82.75 9.89,82.75 10.61,82.03 12.22,82.03 v12.25,82
  Bottom 0.3: v3.75,24 6.5,21.25 v16,21.25 | IC2_GLU.19 22.75,92.75 16.5,86.5 16.5,83.03 15.64,82.17 12.42,82.17 v12.25,82
SND2_READY  (via drill 0.35)
  Top 0.3: v2.03,19.53 2.11,19.53 v3.67,17.97
  Bottom 0.3: U4_SND2.P4 13.97,17.32 13.16,16.5 5.06,16.5 3.67,17.89 v3.67,17.97 | J2-WAITS.3 64,90 65.2,91.2 65.2,94.64 63.97,95.88 52.75,95.88 49.22,92.34 40.5,92.34 39.06,90.91 33.91,90.91 30.25,87.25 24.75,87.25 24,86.5 24,83.25 18.5,77.75 14.5,77.75 14.06,77.31 14.06,69.38 13.44,68.75 1.28,68.75 1.28,20.28 v2.03,19.53
SND3_ENABLE_N  (via drill 0.35)
  Top 0.3: 17.75,31.25 19,31.25 U5_SND3.P6 | 17.75,31.25 16.75,31.25 U5_SND3.P5 | v23.31,87.75 24,87.06 24,82.25 21.25,79.5 21.25,61.56 21.72,61.09 22.25,61.09 23,60.34 23,59.5 20.5,57 20.5,43.53 17.9,40.93 17.9,40.62 18.28,40.23 18.28,39.99 18.16,39.87 18.16,37.75 18.28,37.63 18.28,37.11 17.75,36.58 17.75,31.25
  Bottom 0.3: IC2_GLU.16 30.25,92.75 27.34,89.84 25.41,89.84 v23.31,87.75
SND3_READY  (via drill 0.35)
  Top 0.3: v49.5,64.47 49.5,62.25 51,60.75 51,59 45.53,53.53 44.63,53.53 43.5,52.41 43.5,49.08 v43.59,48.98 | v41.88,48.98 43.73,47.12 45.06,47.12 46.07,46.11 46.07,44.27 47.66,42.69 47.66,41.16 46.36,39.87 46.36,36.47 v46.31,36.42
  Bottom 0.3: v46.31,36.42 46.31,35.72 45.59,35 28.28,35 27.19,33.91 27.19,31.69 24.75,29.25 16,29.25 14.25,31 U5_SND3.P4 | J2-WAITS.7 63.75,84.75 63.75,71.5 61.28,69.03 59.78,69.03 58.75,68 56.88,68 53.47,64.59 49.63,64.59 v49.5,64.47 | v43.59,48.98 v41.88,48.98
SND4_ENABLE_N  (via drill 0.35)
  Top 0.3: v31.72,65 31.72,78.22 34.25,80.75 34.25,91.5 33,92.75 IC2_GLU.15 | v34.39,33.5 34.38,33.52 34.38,36.16 33.5,37.03 33.5,39.42 32.03,40.89 32.03,42.84 33.25,44.06 33.25,58.67 33.2,58.67 32.73,59.14 32.73,59.18 33.07,59.51 33.07,60.43 32.73,60.77 32.73,61.25 32.76,61.27 32.5,61.53 v32.5,63.75
  Bottom 0.3: v34.39,33.5 34.78,33.5 35.42,32.86 39.64,32.86 39.69,32.81 39.69,31.21 U6_SND4.P5 U6_SND4.P6 | v32.5,63.75 32.5,64.22 v31.72,65
SND4_READY  (via drill 0.35)
  Top 0.3: v44.94,54.88 44.09,54.88 40.75,51.53 40.75,48.31 43.53,45.53 43.53,44.27 44.19,43.62 46.09,43.62 47.2,42.5 47.2,41.41 46.23,40.43 39.15,40.43 38.59,39.87 38.59,36.37 37.74,35.52 37.74,32.34 37.17,31.78 U6_SND4.P4
  Bottom 0.3: v44.94,54.88 44.94,54.81 52.97,54.81 59.91,61.75 61.5,61.75 62.25,62.5 62.25,64.78 62,65.03 62,66.56 66,70.56 66,77.88 66.56,78.44 66.56,82.56 68.25,84.25 68.25,91.75 67.25,91.75 66.75,92.25 66.5,92.25 J2-WAITS.2
SNDOUT1
  Top 0.3: C27.+ 44.67,16.14 U11_SND1.P7
SNDOUT2  (via drill 0.35)
  Top 0.3: v28.28,16.75 28.5,16.53 30.63,16.53 31.56,15.59 31.88,15.59 v32.03,15.75
  Bottom 0.3: v28.28,16.75 28.03,16.5 24.22,16.5 23.67,15.95 22.17,15.95 21.56,16.56 21.56,18.51 U4_SND2.P7 | v32.03,15.75 32.28,15.5 35.66,15.5 36.41,14.75 38.5,14.75 C1.+
SYSRES*  (via drill 0.35)
  Top 0.3: U2_VDP.P34 35.29,42.99 34.21,42.99 33.64,42.43 33.64,41.63 34.21,41.07 35.34,41.07 35.97,40.43 37.57,40.43 38.13,39.87 38.13,37.12 36.64,35.62 v36.64,33.75 | v41,33.36 41,24.69 40.75,24.44 40.75,14.77 40,14.02 40,12.73 40.75,11.98 40.75,5.5 R9.1 39.09,5.44 v39.06,5.47 | J2_DATA_AND_POWER_CON.8 39.43,2.52 39.37,2.58 39.37,3.04 38.64,3.77 38.19,3.77 v36.48,5.47
  Bottom 0.3: v36.64,33.75 37.03,33.75 37.03,33.7 40.66,33.7 v41,33.36 | v39.06,5.47 v36.48,5.47
TIED-HIGH-1  (via drill 0.35)
  Top 0.3: v64.59,12.97 64.98,12.58 65.08,12.58 66.69,14.19 66.69,18.25 67.73,19.3 67.73,19.69 68.13,20.08 68.13,22.42 67.73,22.81 67.73,24.61 66.95,25.39 66.06,25.39 65.44,26.02 65.44,31.75 64.2,32.99 RN1.13 | v36.42,8.8 36.42,14.12 34.91,15.64 33.58,15.64 31.69,13.75 IC8_JOY1_BUF.2 | IC8_JOY1_BUF.4 26.42,9.23 v25.94,8.75 | IC8_JOY1_BUF.6 21.34,13.04 21.72,12.66 21.72,9.22 v21.95,8.98
  Bottom 0.3: 21.94,9 v21.95,8.98 22.19,8.75 v25.94,8.75 | IC8_JOY1_BUF.2 31.44,13.5 29.44,11.5 28.44,11.5 26.44,13.5 IC8_JOY1_BUF.4 | v36.42,8.8 41.09,8.8 41.73,9.44 44.2,9.44 44.69,9.92 45.39,9.92 46.95,8.36 49.3,8.36 50.47,9.53 50.47,11.48 51.17,12.19 56.17,12.19 58.28,10.08 62.58,10.08 64.98,12.48 64.98,12.58 v64.59,12.97
TIED-HIGH-2  (via drill 0.35)
  Top 0.3: 62.44,16 62.44,12.75 60.94,11.25 IC1_JOY2_BUF.2 | 62.44,16 60.94,16 IC1_JOY2_BUF.4 | 62.44,16 62.44,19.75 60.94,21.25 IC1_JOY2_BUF.6 | v67.89,50.5 64.44,50.5 RN1.7
  Bottom 0.3: IC1_JOY2_BUF.6 60.94,21.25 64.94,25.25 72.19,25.25 78.94,32 78.94,48 77.45,49.49 75.12,49.49 73.83,48.2 71.72,48.2 69.42,50.5 v67.89,50.5
TMS9118_RW(*)_TMS4416_W(*)
  Top 0.3: U1_TMS_RAM.4 53.5,81.5 54.5,80.5 54.5,72.25 53.5,71.25 53.5,70.75 U3_TMS_RAM.4
  Bottom 0.3: U2_VDP.P11 27,60 29.25,62.25 37.75,62.25 44.75,69.25 52.25,69.25 53.5,70.5 U3_TMS_RAM.4
TMS9918_AD0-TMS4416_A7
  Top 0.3: U1_TMS_RAM.10 40.5,73.75 39.25,72.5 39.25,67.66 40.68,66.23 U3_TMS_RAM.10
  Bottom 0.3: U2_VDP.P10 29.5,60 31.25,61.75 38,61.75 39.5,63.25 40.5,63.25 U3_TMS_RAM.10
TMS9918_AD1-TMS4416_A6  (via drill 0.35)
  Top 0.3: v47.28,67.88 48.5,69.09 48.5,70.5 U3_TMS_RAM.6 | U1_TMS_RAM.6 48.25,81.5 49.5,80.25 49.5,76.38 v49.45,76.33
  Bottom 0.3: U2_VDP.P9 32,60 33.25,61.25 38.28,61.25 39.59,62.56 40.22,61.94 41.14,61.94 41.8,62.59 41.8,64.69 44.98,67.88 v47.28,67.88 | v49.45,76.33 49.45,71.83 U3_TMS_RAM.6
TMS9918_AD2-TMS4416_A5  (via drill 0.35)
  Top 0.3: v37.23,63.08 37.22,63.06 37.22,62.72 34.5,60 U2_VDP.P8 | U1_TMS_RAM.7 45.75,81.5 47,80.25 47,76.38 v46.95,76.33
  Bottom 0.3: v37.23,63.08 37.53,62.78 45.25,70.5 45.75,70.5 U3_TMS_RAM.7 46.88,71.79 46.88,76.25 v46.95,76.33
TMS9918_AD3-TMS4416_A4  (via drill 0.35)
  Top 0.3: U2_VDP.P7 37.03,60.41 38.2,61.58 38.2,64.58 v37.59,65.19 | U1_TMS_RAM.8 43.25,81.5 44.25,80.5 44.25,76.38 v44.3,76.33
  Bottom 0.3: v37.59,65.19 42.91,70.5 43,70.5 U3_TMS_RAM.8 44.3,71.75 v44.3,76.33
TMS9918_AD4-TMS4416_A3
  Top 0.3: U1_TMS_RAM.11 43,73.75 42,72.75 42,64.5 43,63.5 43,63.25 U3_TMS_RAM.11 43.22,60.44 43.23,60.43 43.23,59.4 42.69,58.86 41.41,58.86 40.3,59.97 U2_VDP.P6
TMS9918_AD5-TMS4416_A2  (via drill 0.35)
  Top 0.3: U1_TMS_RAM.12 45.53,73.8 45.53,72.53 44.5,71.5 44.5,66.17 v44.69,66.17 | U3_TMS_RAM.12 45.75,63.25 45.75,64 45.22,64.53 v44.69,64.53
  Bottom 0.3: U2_VDP.P5 42.25,60 45.25,63 45.75,63 U3_TMS_RAM.12 | v44.69,66.17 v44.69,64.53
TMS9918_AD6-TMS4416_A1
  Top 0.3: U1_TMS_RAM.13 48.13,73.91 48.13,72.62 47,71.5 47,69.69 45.78,68.47 45.78,67.44 48.15,65.07 48.15,63.21 U3_TMS_RAM.13
  Bottom 0.3: U2_VDP.P4 44.75,60 48,63.25 48.25,63.25 U3_TMS_RAM.13
TMS9918_AD7-TMS4416_A0  (via drill 0.35)
  Top 0.3: U1_TMS_RAM.14 50.78,73.94 50.78,72.84 49.5,71.56 49.5,68.31 v49.53,68.28 | U3_TMS_RAM.14 51.09,63.31 51.09,65.23 v49.53,66.8
  Bottom 0.3: U2_VDP.P3 47.25,60 50.5,63.25 50.75,63.25 U3_TMS_RAM.14 | v49.53,68.28 v49.53,66.8
TOPOFDIODES
  Top 0.3: JP2-TRG-MD1.3 50.31,90.2 50.31,88.77 D1.1 D2.1
TOPOFDIODES1
  Bottom 0.3: JP1-TRG-MD2.3 42.81,90.43 42.81,87.81 43.59,87.03 D7.1 D3.1
TRIGGER  (via drill 0.35)
  Top 0.3: v72.27,67.7 70.42,67.7 69.63,68.5 69.3,68.5 66.93,70.87 66.93,78.62 62.8,82.75 55.38,82.75 54.69,83.44 54.69,86.42 53.19,87.92 53.19,90.25 JP2-TRG-MD1.2 | v79.11,11.98 79.27,12.14 79.27,72.66 79.14,72.66 78.59,73.2 78.59,73.83 78.77,74 v78.95,74
  Bottom 0.3: v78.95,74 78.41,74 72.27,67.86 v72.27,67.7 | JOYSTICK1.9 79.06,11.94 v79.11,11.98
TRIGGER1  (via drill 0.35)
  Top 0.3: JP1-TRG-MD2.2 45.44,90.5 45.44,91.95 48.13,94.64 67.14,94.64 69.91,91.87 71.8,91.87 72.98,90.69 v72.98,90.67
  Bottom 0.3: v72.98,90.67 72.98,90.62 74.44,89.17 74.44,81 73.06,79.62 JOYSTICK2.9
UP  (via drill 0.35)
  Top 0.3: v71.31,34.27 71.31,34.03 75.75,29.59 75.75,17.39 75.61,17.25 v75.61,16.2 | v46.59,88.62 44.94,88.62 44.19,89.38 44.19,92.7 45.53,94.05 v45.55,94.05 | v69.78,6.75 69.94,6.91 72.47,6.91 74.58,9.02 78.92,9.02 80.17,10.27 80.17,74.69 79.38,75.48 v79.38,90.55 | v76.02,90.55 75.8,90.55 73.06,93.28 70.28,93.28 67.55,96.02 50.08,96.02 v49.81,96.28
  Bottom 0.3: 69.81,7.22 69.81,10.5 JOYSTICK1.5 | 69.81,7.22 69.81,6.75 v69.78,6.75 69.08,6.05 60.23,6.05 58.31,4.12 35.31,4.12 34.94,3.75 34.06,3.75 33.94,3.88 28.44,3.88 26.44,5.88 IC8_JOY1_BUF.17 | v71.31,34.27 71.31,37 70.06,38.25 68.69,38.25 67.64,39.3 66.64,39.3 66.28,39.66 66.28,40.66 64.31,42.62 RN1.10 | v46.59,88.62 46.59,88.5 49.94,88.5 51.19,87.25 D1.2 | v75.61,16.2 79.81,16.2 79.92,16.09 79.92,9.69 72.28,9.69 69.81,7.22 | v76.02,90.55 v79.38,90.55 | v49.81,96.28 49.81,96.05 48.06,94.3 45.8,94.3 v45.55,94.05
UP1  (via drill 0.35)
  Top 0.3: D3.2 46.44,85.62 47.69,86.88 47.69,87.62 49.09,89.03 49.09,91.86 49.88,92.64 53.56,92.64 54.56,91.64 54.56,88 55.45,87.11 56.48,87.11 57.19,86.41 57.19,84.38 58.08,83.48 64.58,83.48 69.81,78.25 JOYSTICK2.5 | IC1_JOY2_BUF.17 53.27,16.21 55.38,18.31 55.38,26.23 57.19,28.05 57.19,29.67 58.28,30.77 58.28,32.33 60.63,34.68 60.63,38.96 61.44,39.77 61.44,44.97 60.55,45.86 v60.55,45.94 | v67.94,68.17 66.63,68.17 65.94,67.48 65.94,59.62 64.31,58 RN1.4
  Bottom 0.3: RN1.4 64.19,57.88 64.19,57.75 61.81,57.75 61.09,57.03 60.08,57.03 59.38,56.33 59.38,55 59.84,54.53 61.41,54.53 62.03,53.91 62.03,51.48 60.55,50 v60.55,45.94 | v67.94,68.17 67.94,72.58 69.89,74.53 JOYSTICK2.5
VCC
  Bottom 0.3: 30.07,38.81 U6_SND4.P16
  pour Bottom: 0.62,0 81.25,0 81.56,0.31 81.56,100 0.62,100
  cutout Top: 36.41,43.2 36.41,40.81 43.2,40.81 43.2,43.2
VDP-RD0  (via drill 0.35)
  Top 0.3: v32.25,55.03 32.25,45 32,44.75 U2_VDP.P32 | v59.75,66.39 59.75,66.94 62.75,69.94 62.75,76.75 58.5,81 58.5,81.5 U1_TMS_RAM.2
  Bottom 0.3: v32.25,55.03 33.47,56.25 53.25,56.25 59.75,62.75 v59.75,66.39
VDP-RD1  (via drill 0.35)
  Top 0.3: v28.22,57.03 28.53,56.72 28.53,45.47 29.25,44.75 U2_VDP.P31
  Bottom 0.3: U1_TMS_RAM.3 55.75,81.5 55.5,81.5 54,80 42.7,80 37.95,75.25 34,75.25 28.5,69.75 26.41,69.75 25.75,69.09 25.75,62.19 23.91,62.19 23.2,61.48 23.2,57.89 24.06,57.03 v28.22,57.03
VDP-RD2  (via drill 0.35)
  Top 0.3: v29.44,64.97 29.44,62.94 28.09,61.59 28.09,59.09 27,58 27,44.75 U2_VDP.P30
  Bottom 0.3: v29.44,64.97 31.72,67.25 36.25,67.25 39,70 39,71.5 39.22,71.72 39.22,74.84 40.16,75.78 41.72,75.78 43.67,77.73 52.73,77.73 53.27,77.2 U1_TMS_RAM.15
VDP-RD3  (via drill 0.35)
  Top 0.3: v25.78,51.25 25.94,51.09 25.94,46.19 24.5,44.75 U2_VDP.P29 | v46.88,52.19 47.09,52.41 49.31,52.41 55.08,58.17 55.08,61.72 54.5,62.3 v54.5,69.12
  Bottom 0.3: v25.78,51.25 26.09,50.94 45.63,50.94 v46.88,52.19 | U1_TMS_RAM.17 58.25,73.75 57.75,73.75 56.19,72.19 55.31,72.19 54.53,71.41 54.53,69.16 v54.5,69.12
VDP-RD4  (via drill 0.35)
  Top 0.3: v23.91,55.19 21.88,53.16 21.88,44.74 U2_VDP.P28 | U3_TMS_RAM.2 58.25,70.5 58.25,68.05 57.85,67.65 57.85,67.23 v57.25,66.62
  Bottom 0.3: v23.91,55.19 24.22,55.5 29.06,55.5 30.92,57.36 51.86,57.36 57.25,62.75 v57.25,66.62
VDP-RD5  (via drill 0.35)
  Top 0.3: v19.5,51.56 19.5,45 19.25,44.75 U2_VDP.P27 | v39.7,52 46,58.3 46,61.25 47,62.25 v47,64.62
  Bottom 0.3: U3_TMS_RAM.3 55.92,68.94 52.52,65.53 47.09,65.53 47.03,65.47 47.03,64.66 v47,64.62 | v19.5,51.56 24.43,51.56 25.11,52.24 26.53,52.24 27.07,51.7 38.59,51.7 38.89,52 v39.7,52
VDP-RD6  (via drill 0.35)
  Top 0.3: v16.75,53.5 16.75,44.75 U2_VDP.P26 | v48,53.5 53.77,59.27 53.77,62.48 53.5,62.75 53.5,63 U3_TMS_RAM.15
  Bottom 0.3: v48,53.5 44.06,53.5 43.5,54.06 17.34,54.06 16.78,53.5 v16.75,53.5
VDP-RD7  (via drill 0.35)
  Top 0.3: v58.25,57.53 58.25,63 U3_TMS_RAM.17
  Bottom 0.3: U2_VDP.P25 14.17,47.33 17.34,50.5 24.38,50.5 24.88,50 47.16,50 47.66,50.5 51.14,50.5 58.17,57.53 v58.25,57.53
VDP_MODE  (via drill 0.35)
  Top 0.3: v19.78,80.66 20.75,79.69 20.75,61.25 21.75,60.25 21.75,60 U2_VDP.P13
  Bottom 0.3: v19.78,80.66 11.38,80.66 8.75,83.28 8.75,87.25 12.66,91.16 12.66,92.86 IC2_GLU.23
VID-VCC  (via drill 0.35)
  Top 0.3: U2_VDP.P33 34.53,44.77 v34.53,48.12 | v57.19,25.78 56.35,25.78 56.35,21.23 v56.48,21.09 | v55.31,29.06 55.31,29.84 54.77,30.39 52.12,30.39 51.09,31.41 51.09,33.77 51.71,34.39 51.71,37.89 51.2,38.39 51.2,39.48 50.46,40.23 50.46,42.12 48.61,43.96 48.61,46.23 v46.56,48.28
  Bottom 0.3: U2_VDP.P33 34.49,42.23 34.69,42.03 L1.1 | v34.53,48.12 34.74,47.91 46.19,47.91 v46.56,48.28 46.62,48.34 49.98,48.34 51.08,47.25 C16.+ | Q2.C 65.31,22.57 65.31,20.62 64.69,20 57.58,20 v56.48,21.09 | v57.19,25.78 57.19,27.19 v55.31,29.06

## Text on the board
tNames: INT* | WAIT* | TRS80GS Decoder | TMS4416 | 10.738635mhz | 74LS74 | TMS4416 | TMS9918A | SN76489 | SN76489 | SN76489 | SN76489 | TRS80MXS Gfx/Snd V1.5 / Joe Rounceville (C) 2020 | 74LS244 | 74LS244